# EAGLE design hacksaw_r0 (EAGLE 7.3.0)

## Sheet 1 of 4: VCO CORE
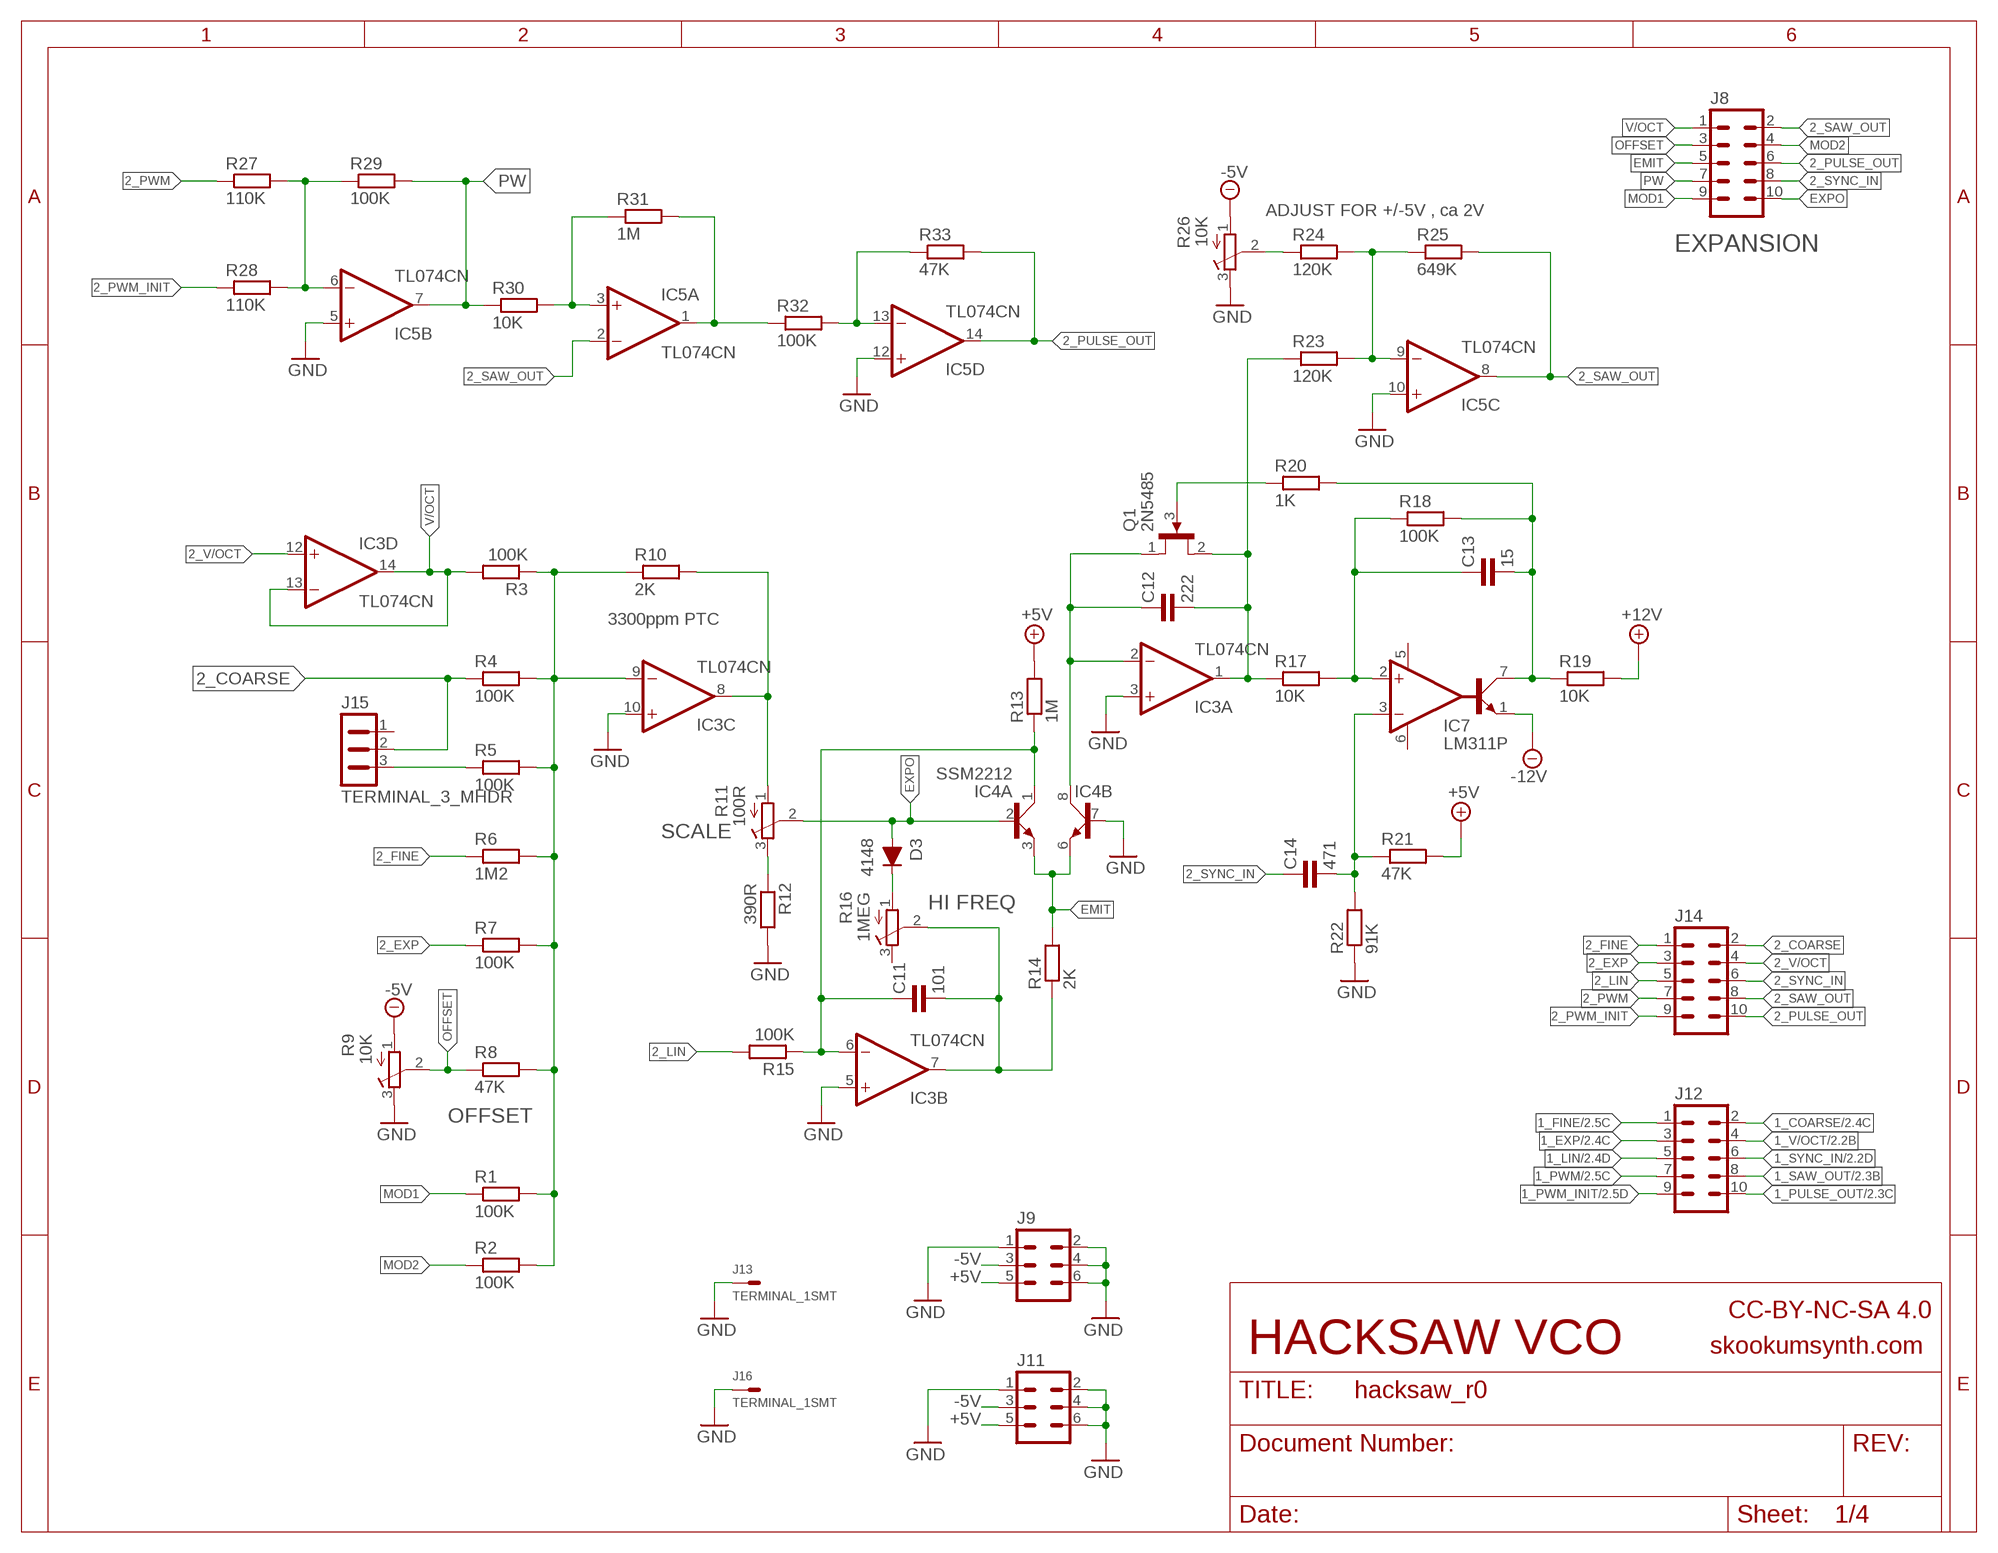
[diagram p0: schematic, sheet 1]

### Parts
C11  101  CAP_0805  [0805]
C12  222  CAP_PHE450  [PHE450]
C13  15  CAP_0805  [0805]
C14  471  CAP_0805  [0805]
D3  4148  DIODE_RECT_SOD123  [SOD123]
IC3  TL074CN  OPAMP_QUAD_DIL14  [DIL14]
IC4  SSM2212  SSM2212*  [DIL8]
IC5  TL074CN  OPAMP_QUAD_DIL14  [DIL14]
IC7  LM311P  [DIL8]
J8  CONN_HDR_5X21  [HDR_M_5X2]
J9  CONN_HDR_3X21  [HDR_M_3X2]
J11  CONN_HDR_3X22  [HDR_M_3X2_REAR]
J12  CONN_HDR_5X22  [HDR_M_5X2_REAR]
J13  TERMINAL_1SMT  [FP_GND]
J14  CONN_HDR_5X21  [HDR_M_5X2]
J15  TERMINAL_3_MHDR  [HDR_M_3]
J16  TERMINAL_1SMT  [FP_GND]
Q1  2N5485  NJFET_2N5485  [TO-92_2]
R1  100K  RESISTOR_0805  [0805]
R2  100K  RESISTOR_0805  [0805]
R3  100K  RESISTOR_0805  [0805]
R4  100K  RESISTOR_0805  [0805]
R5  100K  RESISTOR_0805  [0805]
R6  1M2  RESISTOR_0805  [0805]
R7  100K  RESISTOR_0805  [0805]
R8  47K  RESISTOR_0805  [0805]
R9  10K  RESISTOR_TRIM_PV36W  [PV36W]
R10  2K  RESISTOR_1/4W  [RESISTOR_TH_1/4W]
R11  100R  RESISTOR_TRIM_PV36W  [PV36W]
R12  390R  RESISTOR_0805  [0805]
R13  1M  RESISTOR_0805  [0805]
R14  2K  RESISTOR_0805  [0805]
R15  100K  RESISTOR_0805  [0805]
R16  1MEG  RESISTOR_TRIM_PV36W  [PV36W]
R17  10K  RESISTOR_0805  [0805]
R18  100K  RESISTOR_0805  [0805]
R19  10K  RESISTOR_0805  [0805]
R20  1K  RESISTOR_0805  [0805]
R21  47K  RESISTOR_0805  [0805]
R22  91K  RESISTOR_0805  [0805]
R23  120K  RESISTOR_0805  [0805]
R24  120K  RESISTOR_0805  [0805]
R25  649K  RESISTOR_0805  [0805]
R26  10K  RESISTOR_TRIM_PV36W  [PV36W]
R27  110K  RESISTOR_0805  [0805]
R28  110K  RESISTOR_0805  [0805]
R29  100K  RESISTOR_0805  [0805]
R30  10K  RESISTOR_0805  [0805]
R31  1M  RESISTOR_0805  [0805]
R32  100K  RESISTOR_0805  [0805]
R33  47K  RESISTOR_0805  [0805]

### Nets
1_COARSE: J12.2 ; also sheet 2
1_EXP: J12.3 ; also sheet 2
1_FINE: J12.1 ; also sheet 2
1_LIN: J12.5 ; also sheet 2
1_PULSE_OUT: J12.10 ; also sheet 2
1_PWM: J12.7 ; also sheet 2
1_PWM_INIT: J12.9 ; also sheet 2
1_SAW_OUT: J12.8 ; also sheet 2
1_SYNC_IN: J12.6 ; also sheet 2
1_V/OCT: J12.4 ; also sheet 2
2_COARSE: J14.2 J15.2 R4.1
2_EXP: J14.3 R7.1
2_FINE: J14.1 R6.1
2_LIN: J14.5 R15.2
2_PULSE_OUT: IC5.14(D:OUT) J8.6 J14.10 R33.2
2_PWM: J14.7 R27.1
2_PWM_INIT: J14.9 R28.1
2_SAW_OUT: IC5.2(A:-IN) IC5.8(C:OUT) J8.2 J14.8 R25.2
2_SYNC_IN: C14.1(+) J8.8 J14.6
2_SYNC_PULSE: C13.2(-) IC7.7(COL) R18.2 R19.1 R20.2
2_V/OCT: IC3.12(D:+IN) J14.4
+5V: J9.5 J11.5 R13.2 R21.2 ; also sheet 2,3
+12V: R19.2 ; also sheet 3
-5V: J9.3 J11.3 R9.1 R26.1 ; also sheet 2,3
-12V: IC7.1(EMIT) ; also sheet 3
C1: C11.1(+) IC3.6(B:-IN) IC4.1(A:C) R13.1 R15.1
C2: C12.1(+) IC3.2(A:-IN) IC4.8(B:C) Q1.1(D)
CV: IC3.8(C:OUT) R10.2 R11.1
EMIT: IC4.3(A:E) IC4.6(B:E) J8.5 R14.2
EXPO: D3.A IC4.2(A:B) J8.10 R11.2
GND: IC3.3(A:+IN) IC3.5(B:+IN) IC3.10(C:+IN) IC4.7(B:B) IC5.5(B:+IN) IC5.10(C:+IN) IC5.12(D:+IN) J9.1 J9.2 J9.4 J9.6 J11.1 J11.2 J11.4 J11.6 J13.P$1 J16.P$1 R9.3 R12.2 R22.1 R26.3 ; also sheet 2,3,4
MOD1: J8.9 R1.1
MOD2: J8.4 R2.1
N$3: C13.1(+) IC7.2(+IN) R17.2 R18.1
N$5: R11.3 R12.1
N$6: IC5.1(A:OUT) R31.2 R32.1
N$8: D3.K(C) R16.1
N$9: IC5.6(B:-IN) R27.2 R28.2 R29.1
N$10: Q1.3(G) R20.1
N$11: IC5.3(A:+IN) R30.2 R31.1
N$16: J15.3 R5.1
N$17: IC5.13(D:-IN) R32.2 R33.1
N$19: IC3.9(C:-IN) R1.2 R2.2 R3.1 R4.2 R5.2 R6.2 R7.2 R8.2 R10.1
N$30: IC5.9(C:-IN) R23.2 R24.2 R25.1
N$33: R24.1 R26.2
N$54: C11.2(-) IC3.7(B:OUT) R14.1 R16.2
OFFSET: J8.3 R8.1 R9.2
PW: IC5.7(B:OUT) J8.7 R29.2 R30.1
RAW: C12.2(-) IC3.1(A:OUT) Q1.2(S) R17.1 R23.1
RESET: C14.2(-) IC7.3(-IN) R21.1 R22.2
V/OCT: IC3.13(D:-IN) IC3.14(D:OUT) J8.1 R3.2
Unconnected: IC7.5(BAL) IC7.6(BAL/STROBE) J15.1 R16.3

### Notes on the sheet
- ADJUST FOR +/-5V , ca 2V
- EXPANSION
- 3300ppm PTC
- SCALE
- HI FREQ
- OFFSET
- CC-BY-NC-SA 4.0
- HACKSAW VCO | skookumsynth.com

## Sheet 2 of 4: INTERFACE
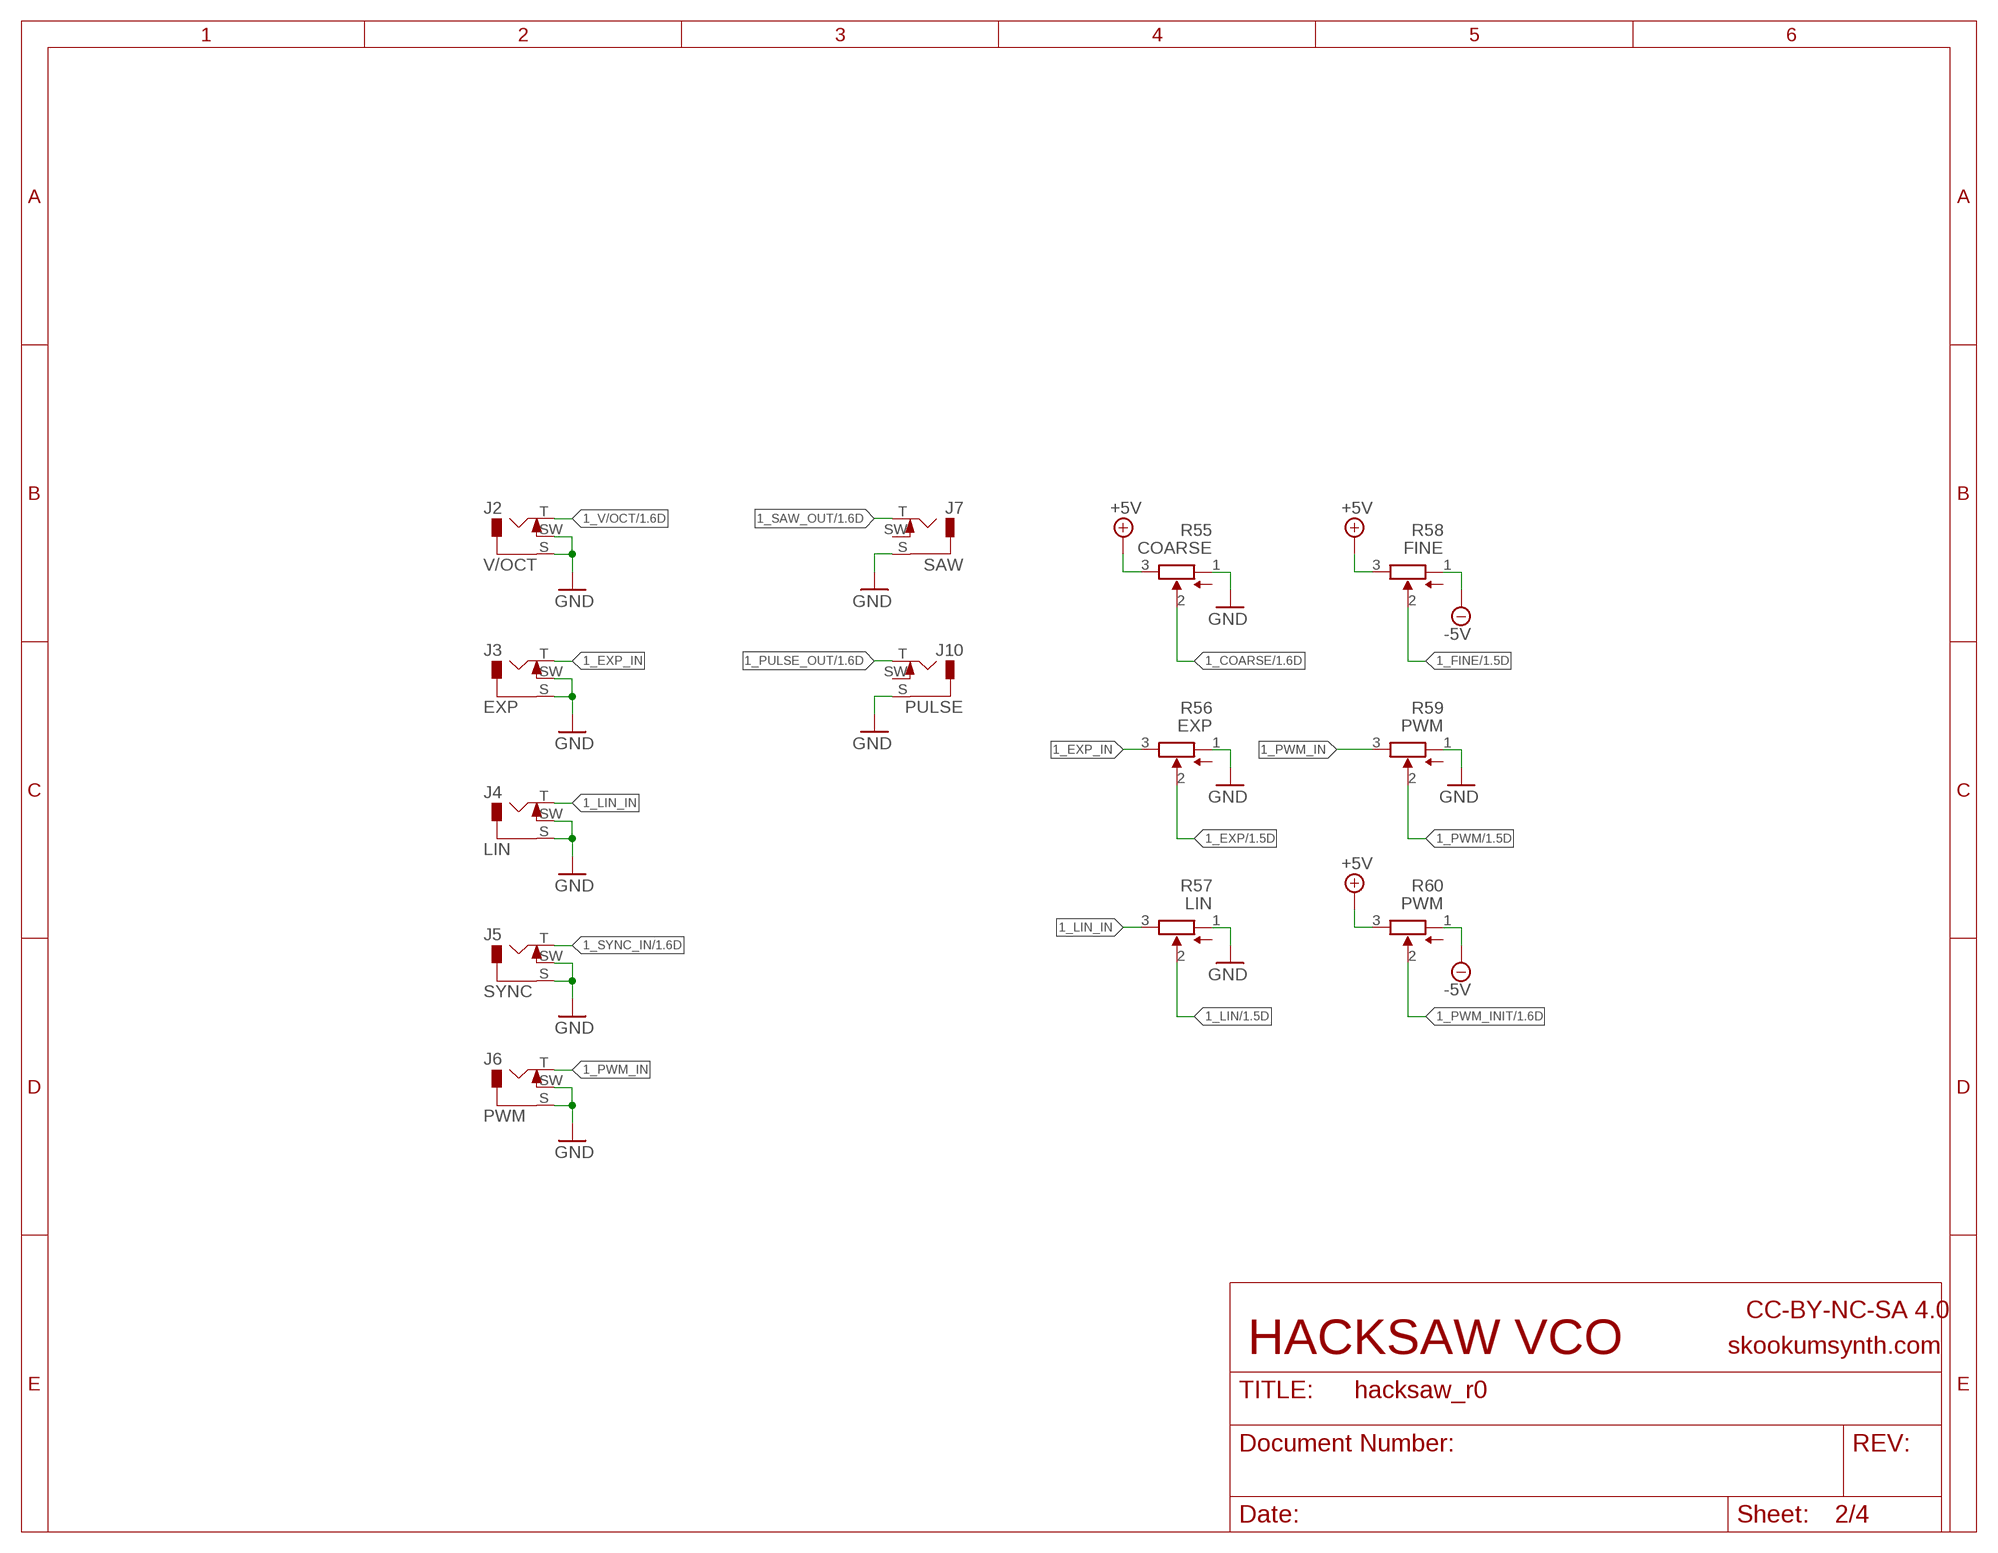
[diagram p1: schematic, sheet 2]

### Parts
J2  V/OCT  CONN_MONO_SW_F_V  [WQP_PJ301M-12]
J3  EXP  CONN_MONO_SW_F_V  [WQP_PJ301M-12]
J4  LIN  CONN_MONO_SW_F_V  [WQP_PJ301M-12]
J5  SYNC  CONN_MONO_SW_F_V  [WQP_PJ301M-12]
J6  PWM  CONN_MONO_SW_F_V  [WQP_PJ301M-12]
J7  SAW  CONN_MONO_SW_F_V  [WQP_PJ301M-12]
J10  PULSE  CONN_MONO_SW_F_V  [WQP_PJ301M-12]
R55  COARSE  POTENTIOMETER-A6  [PTV09]
R56  EXP  POTENTIOMETER-A6  [PTV09]
R57  LIN  POTENTIOMETER-A6  [PTV09]
R58  FINE  POTENTIOMETER-A6  [PTV09]
R59  PWM  POTENTIOMETER-A6  [PTV09]
R60  PWM  POTENTIOMETER-A6  [PTV09]

### Nets
1_COARSE: R55.2 ; also sheet 1
1_EXP: R56.2 ; also sheet 1
1_EXP_IN: J3.T R56.3
1_FINE: R58.2 ; also sheet 1
1_LIN: R57.2 ; also sheet 1
1_LIN_IN: J4.T R57.3
1_PULSE_OUT: J10.T ; also sheet 1
1_PWM: R59.2 ; also sheet 1
1_PWM_IN: J6.T R59.3
1_PWM_INIT: R60.2 ; also sheet 1
1_SAW_OUT: J7.T ; also sheet 1
1_SYNC_IN: J5.T ; also sheet 1
1_V/OCT: J2.T ; also sheet 1
+5V: R55.3 R58.3 R60.3 ; also sheet 1,3
-5V: R58.1 R60.1 ; also sheet 1,3
GND: J2.S J2.SW J3.S J3.SW J4.S J4.SW J5.S J5.SW J6.S J6.SW J7.S J10.S R55.1 R56.1 R57.1 R59.1 ; also sheet 1,3,4
Unconnected: J7.SW J10.SW

### Notes on the sheet
- CC-BY-NC-SA 4.0
- HACKSAW VCO | skookumsynth.com

## Sheet 3 of 4: POWER
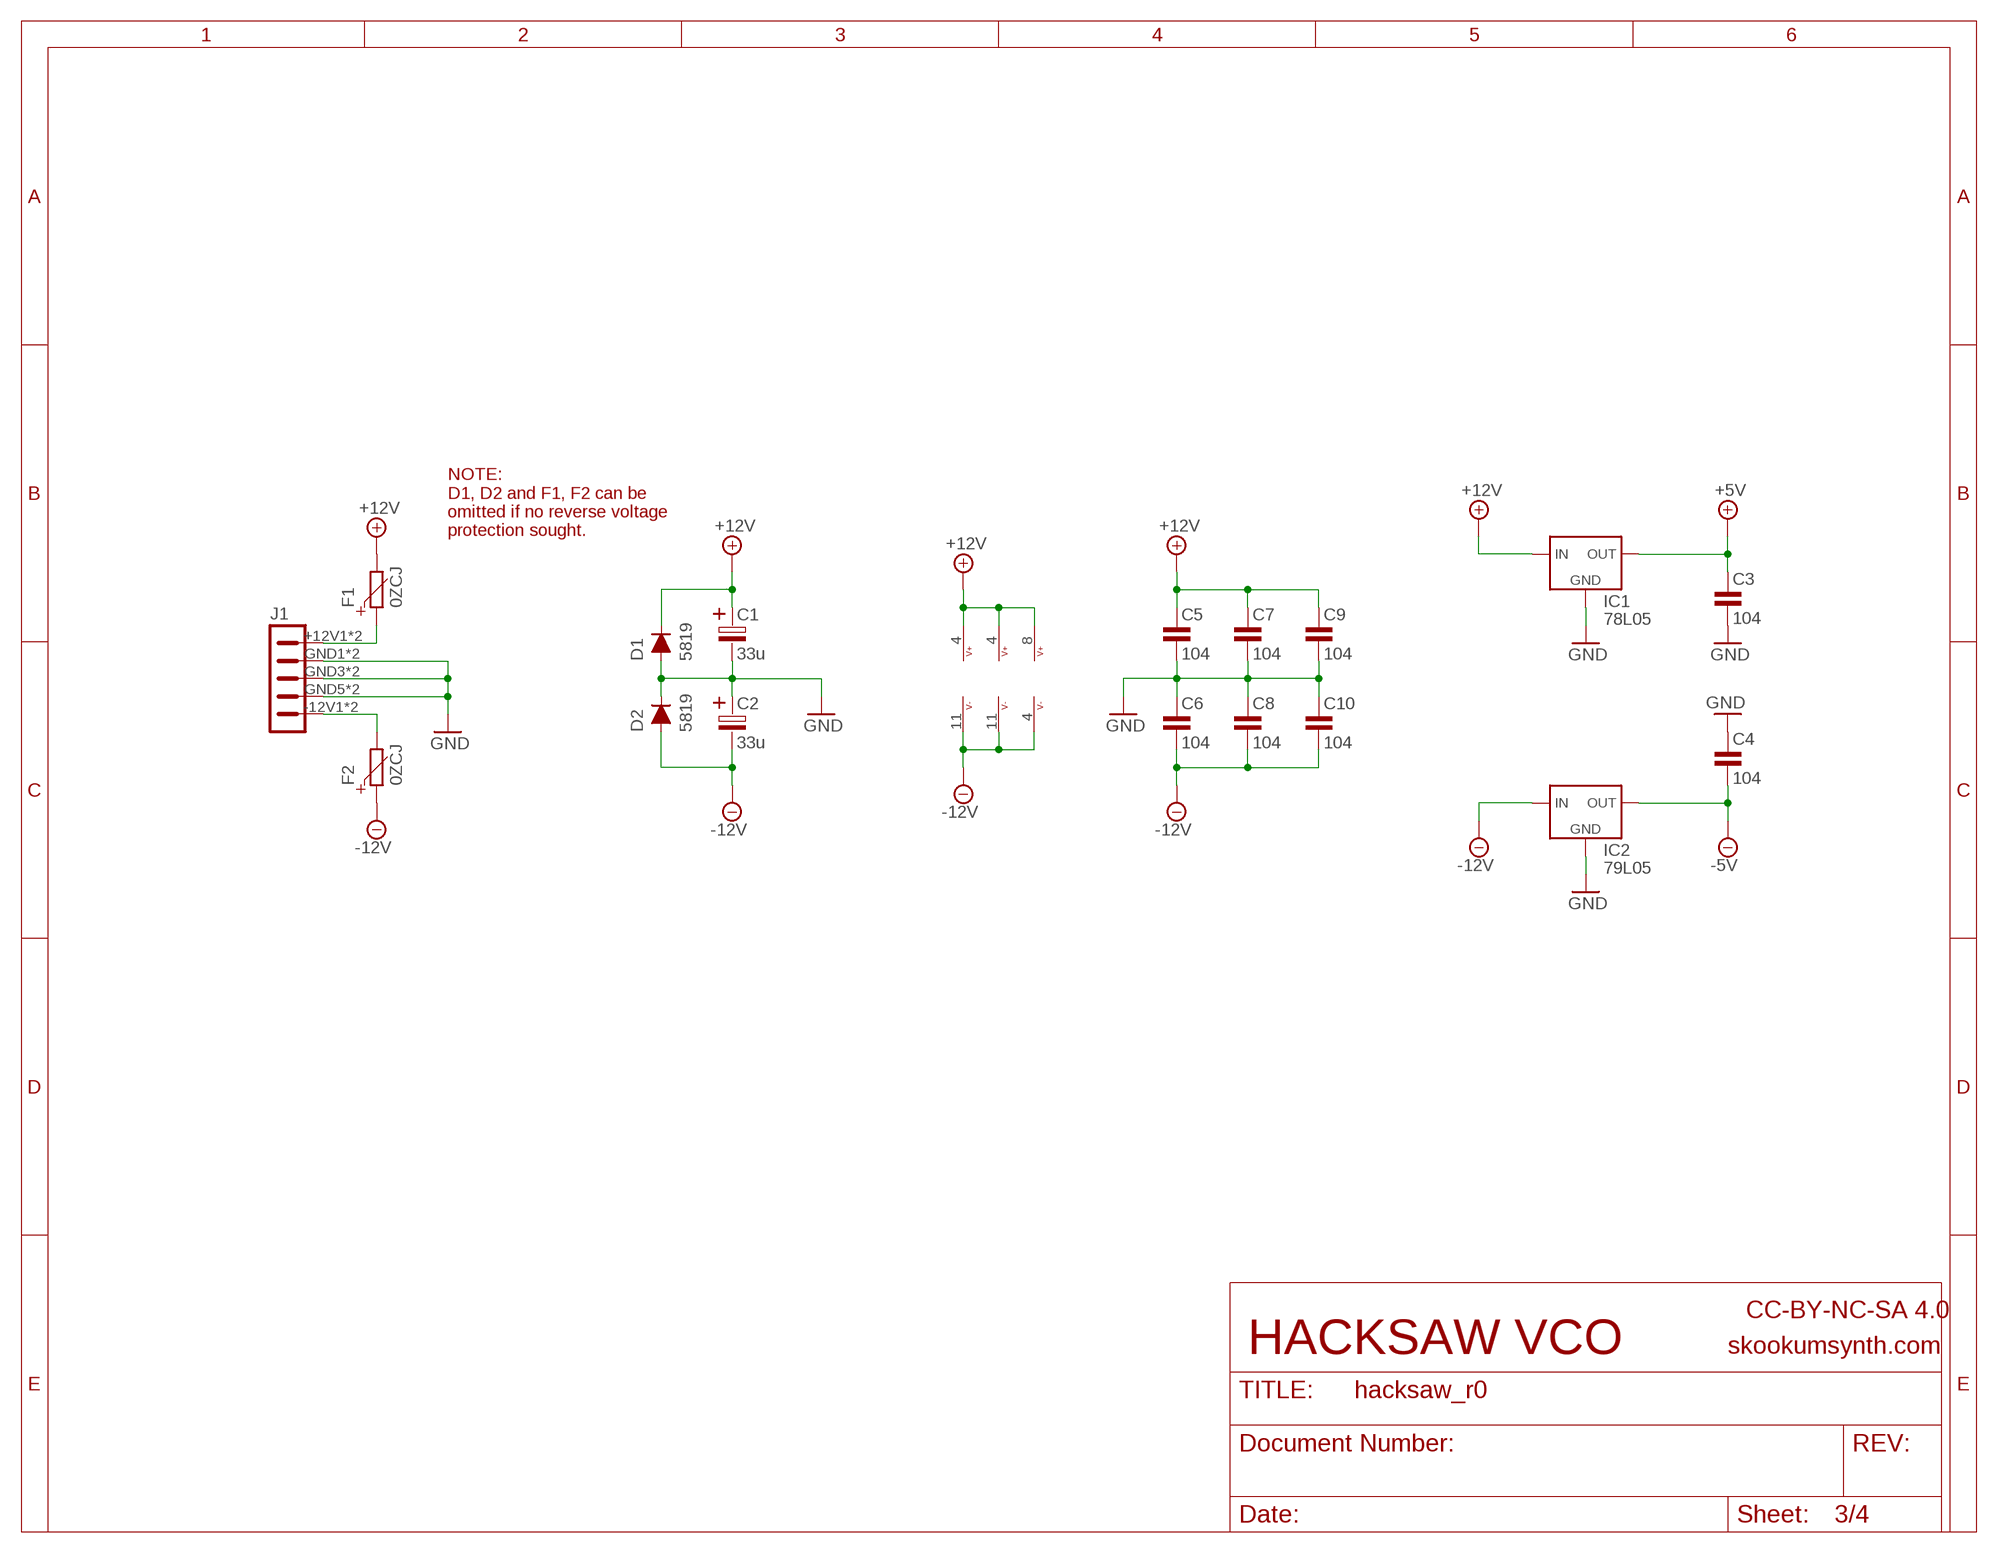
[diagram p2: schematic, sheet 3]

### Parts
C1  33u  CAP_POL_PTH_2.5-6  [CAP_POL_2.5-6]
C2  33u  CAP_POL_PTH_2.5-6  [CAP_POL_2.5-6]
C3  104  CAP_0805  [0805]
C4  104  CAP_0805  [0805]
C5  104  CAP_0805  [0805]
C6  104  CAP_0805  [0805]
C7  104  CAP_0805  [0805]
C8  104  CAP_0805  [0805]
C9  104  CAP_0805  [0805]
C10  104  CAP_0805  [0805]
D1  5819  DIODE_RECT_SOD123  [SOD123]
D2  5819  DIODE_RECT_SOD123  [SOD123]
F1  0ZCJ  PTC_0ZCJ  [1206]
F2  0ZCJ  PTC_0ZCJ  [1206]
IC1  78L05  78LXXACLPR  [TO-92_2]
IC2  79L05  79LXXACLPR  [TO-92_2]
J1  HDR_POWER_10_VERT  [HDR_POWER_10]

### Nets
+5V: C3.1(+) IC1.1(OUT) ; also sheet 1,2
+12V: C1.+ C5.1(+) C7.1(+) C9.1(+) D1.K(C) F1.2 IC1.3(IN) IC3.4(PWR:V+) IC5.4(PWR:V+) IC7.8(V+) ; also sheet 1
-5V: C4.2(-) IC2.3(OUT) ; also sheet 1,2
-12V: C2.- C6.2(-) C8.2(-) C10.2(-) D2.A F2.1 IC2.2(IN) IC3.11(PWR:V-) IC5.11(PWR:V-) IC7.4(V-) ; also sheet 1
GND: C1.- C2.+ C3.2(-) C4.1(+) C5.2(-) C6.1(+) C7.2(-) C8.1(+) C9.2(-) C10.1(+) D1.A D2.K(C) IC1.2(GND) IC2.1(GND) J1.GND1 J1.GND2 J1.GND3 J1.GND4 J1.GND5 J1.GND6 ; also sheet 1,2,4
N$4: F1.1 J1.+12V1 J1.+12V2
N$41: F2.2 J1.-12V1 J1.-12V2

### Notes on the sheet
- NOTE:
  D1, D2 and F1, F2 can be
  omitted if no reverse voltage 
  protection sought.
- CC-BY-NC-SA 4.0
- HACKSAW VCO | skookumsynth.com

## Sheet 4 of 4: MECHANICAL
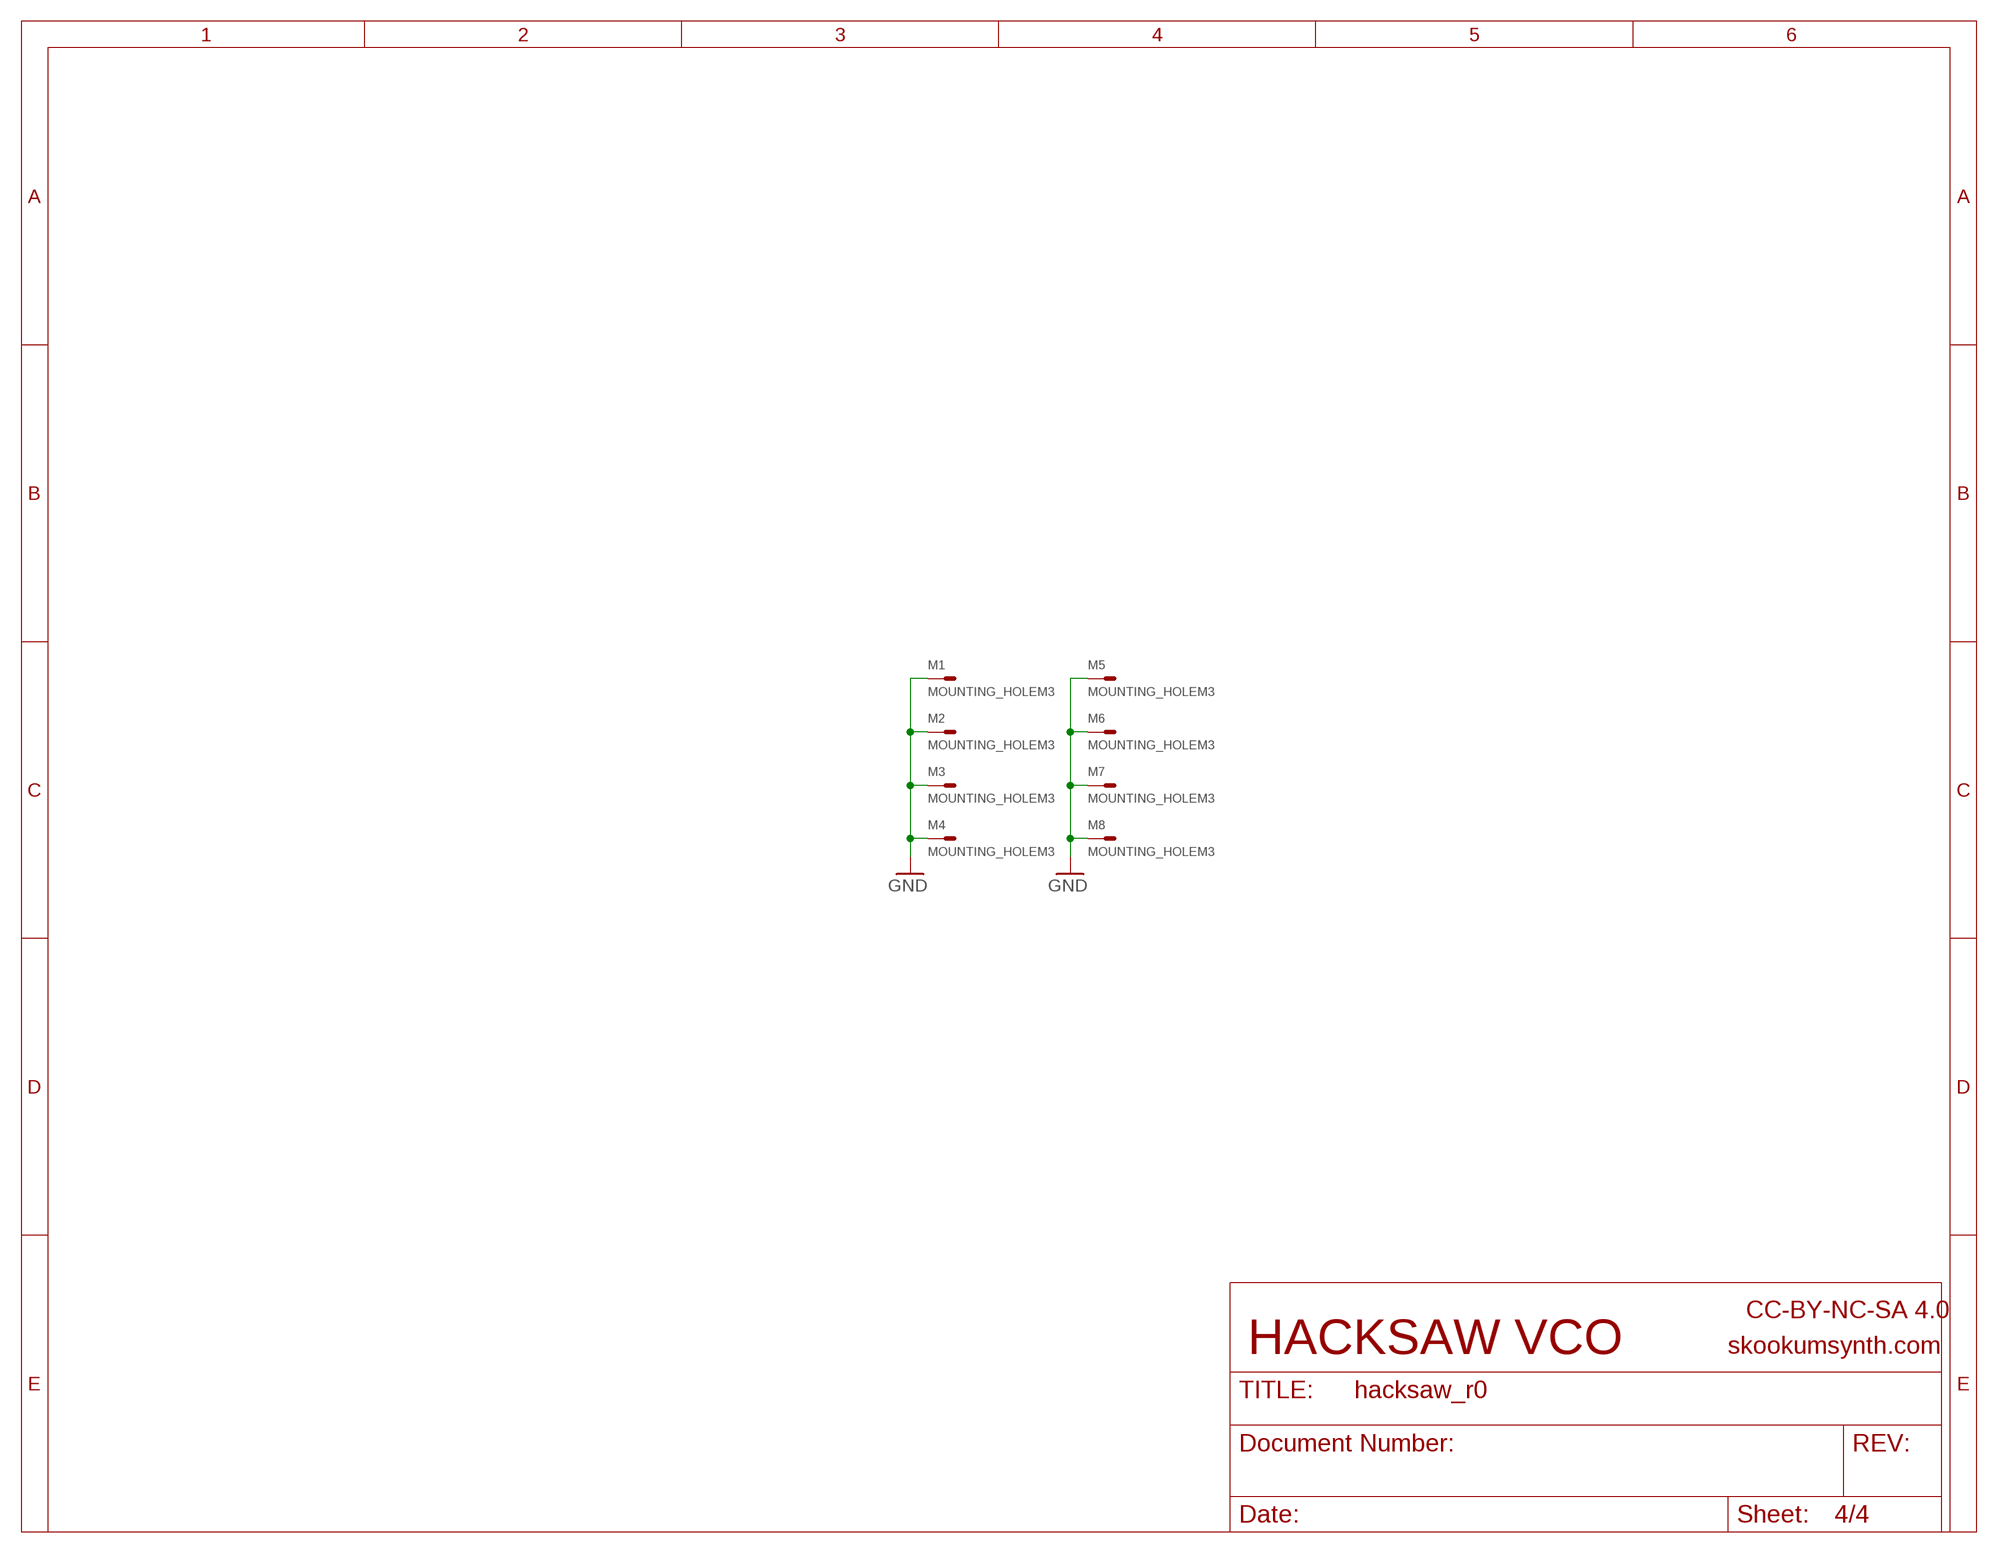
[diagram p3: schematic, sheet 4]

### Parts
M1  MOUNTING_HOLEM3  [M3]
M2  MOUNTING_HOLEM3  [M3]
M3  MOUNTING_HOLEM3  [M3]
M4  MOUNTING_HOLEM3  [M3]
M5  MOUNTING_HOLEM3  [M3]
M6  MOUNTING_HOLEM3  [M3]
M7  MOUNTING_HOLEM3  [M3]
M8  MOUNTING_HOLEM3  [M3]

### Nets
GND: M1.M3 M2.M3 M3.M3 M4.M3 M5.M3 M6.M3 M7.M3 M8.M3 ; also sheet 1,2,3

### Notes on the sheet
- CC-BY-NC-SA 4.0
- HACKSAW VCO | skookumsynth.com

## Library data of the parts
C1 C2 = 000:CAP_POL: Capacitor - Polarized
C3-C14 = 000:CAP: Capacitor - Non-polarized
D1-D3 = 000:DIODE_RECT: Diode, rectifier, generic
F1 F2 = 000:PTC: BELFUSE 0ZCJ SERIES MURATA PTGL SERIES
IC1 = 000:78LXX: *UNVERIFIED* 78LXX - Fixed voltage regulator. This series of fixed-voltage integrated-circuit voltage regulators is designed for a wide range of applications. These applications include on-card regulation for elimination of noise and distribution problems associated with single-point regulation. In addition, they can be used with power-pass elements • Internal Short-Circuit Current Limiting to make high-current voltage regulators. One of these regulators can deliver up to 100 mA of output current. The internal limiting and thermal-shutdown features of these regulators essentially make them immune to overload. When used as a replacement for a Zener diode-resistor combination, an effective improvement in output impedance can be obtained, together with lower bias current. The μ A78L00C and μ A78L00AC series devices are characterized for operation over the virtual junction temperature range of 0 ° C to 125 ° C. The μ A78L05AI device is characterized for operation over the virtual junction temperature range of − 40 ° C to 125 ° C. MFG Part no.: UA78L05ACLPR Digi-Key Part no.: 296-1365-1-ND Mouser Part no.: - Datasheet: http://www.ti.com/lit/ds/symlink/ua78l10a.pdf
IC2 = 000:79LXX: *UNVERIFIED* 79LXX - Fixed negative voltage regulator. This series of fixed negative-voltage integrated-circuit voltage regulators is designed for a wide range of applications. These include on-card regulation for elimination of noise and distribution problems associated with single-point regulation. In addition, they can be used to control series pass elements to make high-current voltage-regulator circuits. One of these regulators can deliver up to 100 mA of output current. The internal current-limiting and thermal-shutdown features essentially make the regulators immune to overload. When used as a replacement for a Zener-diode and resistor combination, these devices can provide an effective improvement in output impedance of two orders of magnitude, with lower bias current. MFG Part no.: MC79L05ACLPR Digi-Key Part no.: 296-31456-1-ND Mouser Part no.: - Datasheet: http://www.ti.com/lit/ds/symlink/mc79l05a.pdf
IC3 IC5 = 000:OPAMP_QUAD
IC4 = 000:SSM2212: *UNVERIFIED* The SSM2212 is a dual, NPN-matched transistor pair that is specifically designed to meet the requirements of ultralow noise audio systems. With its extremely low input base spreading resistance (rbb' is typically 28 Ω) and high current gain (h FE typically exceeds 600 at I C = 1 mA), the SSM2212 can achieve outstanding signal-to-noise ratios. The high current gain results in superior performance compared to systems incorporating commercially available monolithic amplifiers. Excellent matching of the current gain (Δh FE ) to approximately 0.5% and low V OS of less than 10 μV typical make the SSM2212 ideal for symmetrically balanced designs, which reduce high- order amplifier harmonic distortion. Stability of the matching parameters is guaranteed by protection diodes across the base-emitter junction. These diodes prevent degradation of beta and matching characteristics due to reverse biasing of the base-emitter junction. The SSM2212 is also an ideal choice for accurate and reliable current biasing and mirroring circuits. Furthermore, because the accuracy of a current mirror degrades exponentially with mismatches of V BE between transistor pairs, the low V OS of the SSM2212 does not need offset trimming in most circuit applications. The SSM2212 SOIC performance and characteristics are guaranteed over the extended temperature range of −40°C to +85°C. The SSM2212 is available in 8-lead SOIC and 16-lead LFCSP packages.
IC7 = 000:LM311
J1 = 000:HDR_POWER_10: 10 Pin Euroack power header with -12V indication CNC Tech P/N: 3020-10-0100-00 - VERTICAL 3020-10-0200-00 - RIGHT ANGLE
J2-J7 J10 = 000:CONN_MONO_SW_F: 3.5mm mono switched jacks WQP-PJ301M-12 - Available at: http://erthenvar.com and http://www.thonk.co.uk/
J8 J12 J14 = 000:CONN_HDR_5X2
J9 J11 = 000:CONN_HDR_3X2
J13 J16 = 000:TERMINAL_1
J15 = 000:TERMINAL_3
M1-M8 = 000:MOUNTING_HOLE
Q1 = 000:NJFET: *UNVERIFIED*
R1-R8 R10 R12-R15 R17-R25 R27-R33 = 000:RESISTOR: RESISTOR - THROUGH HOLE Footprint based on Stackpole Electronics RNF series 1/4W = RNF14 2W = Vishay PRO2
R9 R11 R16 R26 = 000:RESISTOR_TRIM: Trim Resistor - Generic Package based on: Bourns PV36W
R55-R60 = 000:POTENTIOMETER: *UNVERIFIED* BOURNS PTV09A-6 NOTE: USE MILLING LAYER FOR SLOTS Panel controls are designed for applications that typically require frequent adjustment. Both rotary and slide panel control types are available. A selection of elements includes carbon, cermet, and conductive plastic. These devices are available in various sizes and shaft/bushing combinations. Some models are available with a rotary switch and seal options. Typical applications include audio mixing consoles, test and measurement equipment, consumer electronics, and medical equipment.Turns-counting dials are designed for use with precision rotary potentiometers or other types of panel controls where a turns-indicating device or an adjustment setting/locking device is needed. These devices are available to fit various shaft sizes in digital or concentric scale (analog) readout options. Typical applications include power supplies, oscilloscopes, medical equipment, and industrial automation equipment.

## Board
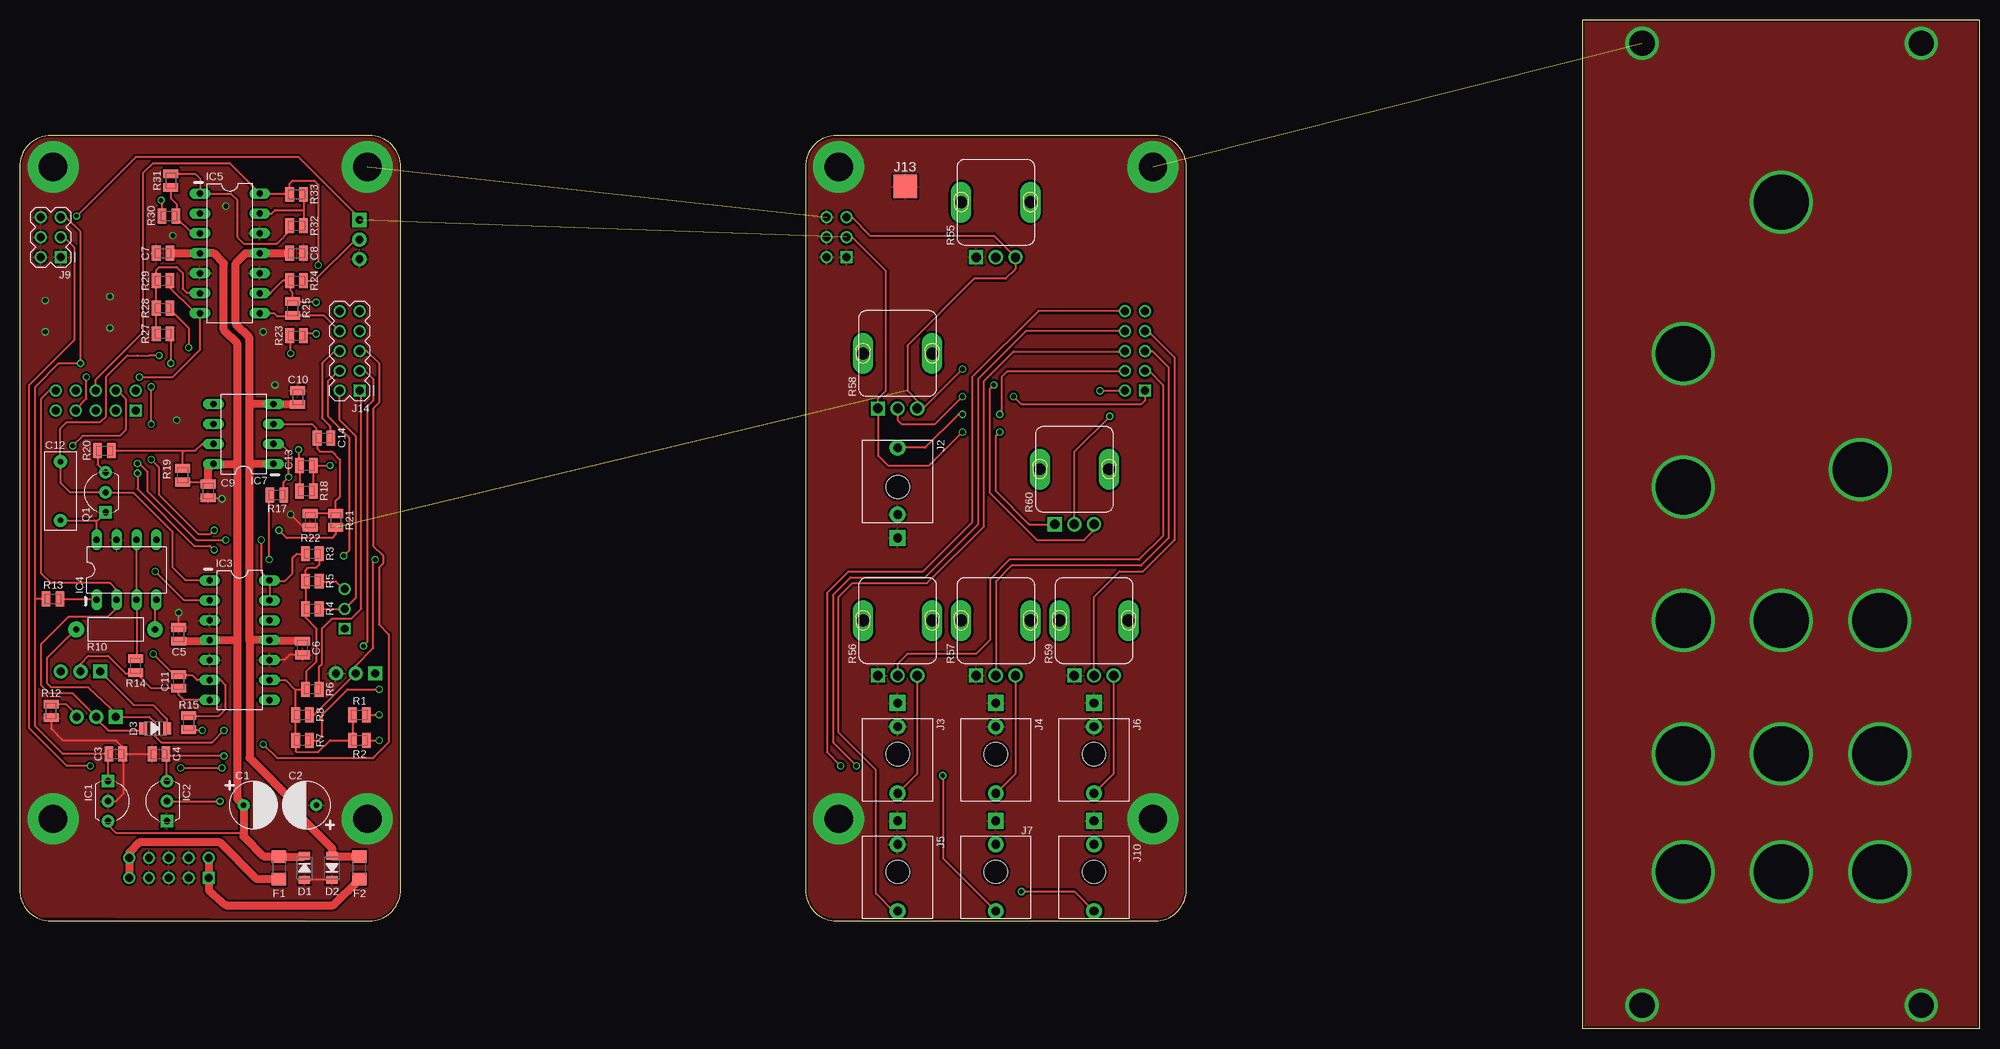
[diagram p4: board, top side]
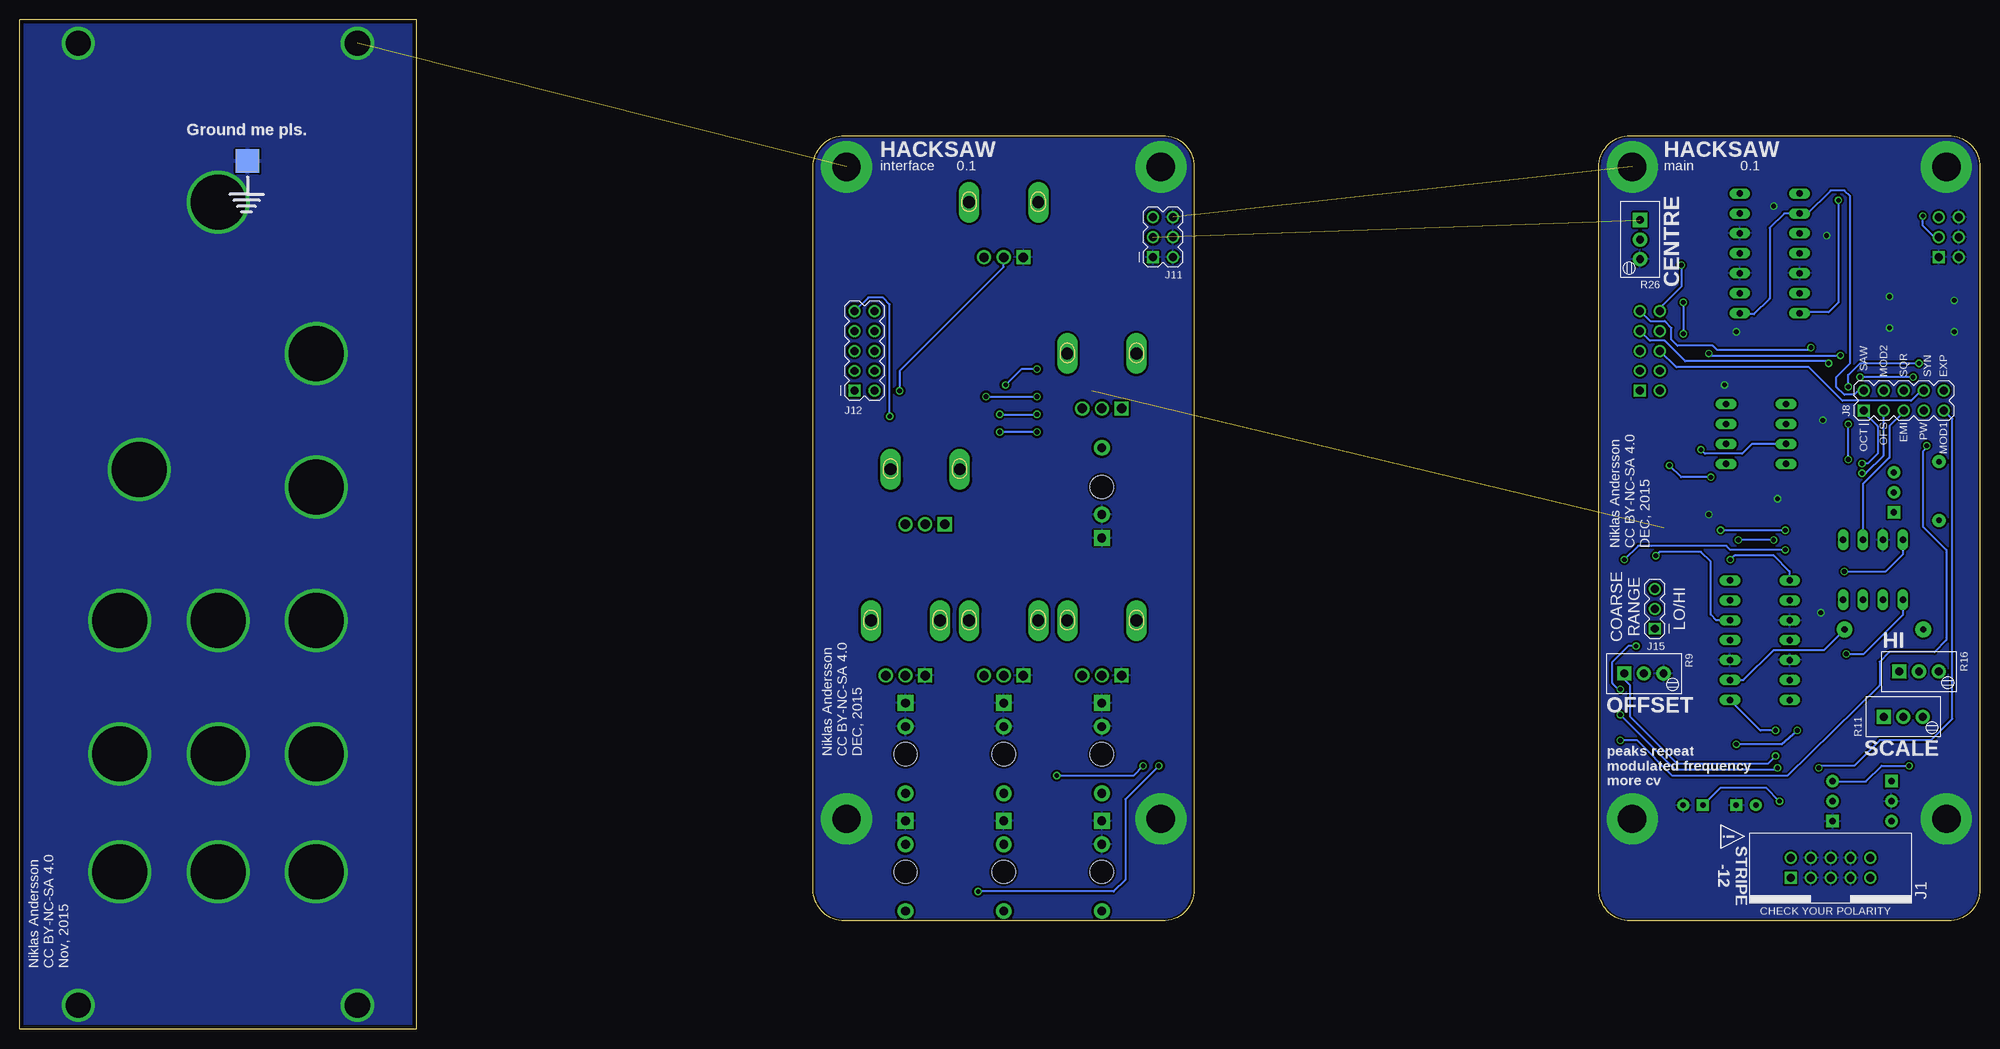
[diagram p5: board, bottom side, seen from below]

Size 249.5 x 128.5 mm. Coordinates in mm from the lower left corner, seen from the top.
Outline: 148.5,17.75 148.5,109.75 arc90 144.5,113.75 104,113.75 arc90 100,109.75 100,17.75 arc90 104,13.75 144.5,13.75 arc90 148.5,17.75
Outline: 249.5,0 199,0 199,128.5 249.5,128.5 249.5,0
Outline: 4,13.75 44.5,13.75 arc90 48.5,17.75 48.5,109.75 arc90 44.5,113.75 4,113.75 arc90 0,109.75 0,17.75 arc90 4,13.75
Copper layers (1*16): Top 0.035mm / dielectric 1.5mm / Bottom 0.035mm
Design rules "dirt_cheap_dirty_boards.v1 *": minimum track width 5mil, minimum drill 12mil, track to track 6mil, track to pad 6mil, pad to pad 6mil, via to via 6mil, smd to smd 0mil, copper to edge 10mil, drill to drill 10mil, minimum pad ring 10mil, minimum via ring 6mil, stop-mask expansion 2mil, vias tented up to drill 25mil, thermal gap 10mil

### Footprints (pad centres in the part's own frame; a part is rotated, then mirrored left to right if it is on the bottom)
CAP_POL_2.5-6 = drill 0.7 pad 1.5: + -1.25,0 | drill 0.7 pad 1.5 square: - 1.25,0
0805 = smd 1.1 x 1.9: 1 -0.875,0; 2 0.875,0
PHE450 = drill 0.7 pad 1.7: 1 -3.75,0; 2 3.75,0
SOD123 = smd 1 x 1.5: A 1.525,0; K -1.525,0
1206 = smd 1.6 x 1.803: 1 -1.422,0; 2 1.422,0
TO-92_2 = drill 0.8 pad 1.6 square: 1 -2.54,0 | drill 0.8 pad 1.6: 2 0,0; 3 2.54,0
DIL14 = drill 0.813 long: 1 -7.62,-3.81; 2 -5.08,-3.81; 3 -2.54,-3.81; 4 0,-3.81; 5 2.54,-3.81; 6 5.08,-3.81; 7 7.62,-3.81; 8 7.62,3.81; 9 5.08,3.81; 10 2.54,3.81; 11 0,3.81; 12 -2.54,3.81; 13 -5.08,3.81; 14 -7.62,3.81
DIL8 = drill 0.813 long: 1 -3.81,-3.81; 2 -1.27,-3.81; 3 1.27,-3.81; 4 3.81,-3.81; 5 3.81,3.81; 6 1.27,3.81; 7 -1.27,3.81; 8 -3.81,3.81
HDR_POWER_10 = drill 1.016: +12V1 5.08,1.27; +12V2 5.08,-1.27; -12V1 -5.08,1.27; GND1 2.54,1.27; GND2 2.54,-1.27; GND3 0,1.27; GND4 0,-1.27; GND5 -2.54,1.27; GND6 -2.54,-1.27 | drill 1.016 square: -12V2 -5.08,-1.27
WQP_PJ301M-12 = drill 1.1 pad 2 square: S 0,-6.5 | drill 1.1 pad 2: SW 0,-3.5; T 0,5 | hole 3: 0,0
HDR_M_5X2 = drill 1.016 square: 1 0,0 | drill 1.016: 2 0,2.54; 3 2.54,0; 4 2.54,2.54; 5 5.08,0; 6 5.08,2.54; 7 7.62,0; 8 7.62,2.54; 9 10.16,0; 10 10.16,2.54
HDR_M_3X2 = drill 1.016 square: 1 0,0 | drill 1.016: 2 0,2.54; 3 2.54,0; 4 2.54,2.54; 5 5.08,0; 6 5.08,2.54
HDR_M_3X2_REAR = drill 1.016 square: 1 0,0 | drill 1.016: 2 0,2.54; 3 2.54,0; 4 2.54,2.54; 5 5.08,0; 6 5.08,2.54
HDR_M_5X2_REAR = drill 1.016 square: 1 0,0 | drill 1.016: 2 0,2.54; 3 2.54,0; 4 2.54,2.54; 5 5.08,0; 6 5.08,2.54; 7 7.62,0; 8 7.62,2.54; 9 10.16,0; 10 10.16,2.54
FP_GND = smd 3 x 3 bottom: P$1 0,0
HDR_M_3 = drill 1.016 square: 1 -2.54,0 | drill 1.016: 2 0,0; 3 2.54,0
M3 = drill 3.6 pad 6.5: M3 0,0
PV36W = drill 1 pad 1.8 square: 1 -2.5,0 | drill 1 pad 1.8: 2 0,0; 3 2.5,0
RESISTOR_TH_1/4W = drill 0.8 pad 2: 1 -5,0; 2 5,0
PTV09 = drill 1.2 pad 1.8 square: 1 -2.5,-7 | drill 1.2 pad 1.8: 2 0,-7; 3 2.5,-7 | drill 1.5 pad 2.6 long: NC1 -4.4,0; NC2 4.4,0

### Placement (x,y rotation side)
C1  29.75,28.5 0 top
C2  36.5,28.5 180 top
C3  12.25,35 0 top
C4  17.75,35 0 top
C5  20.25,50.25 90 top
C6  36,48.5 90 top
C7  18.25,98.75 180 top
C8  35.25,98.75 180 top
C9  24,68.5 270 top
C10  35.41,80.41 270 top
C11  20.25,44.25 270 top
C12  5.18,68.49 90 top
C13  36.5,71.75 180 top
C14  38.75,75.25 180 top
D1  36.25,20.5 270 top
D2  39.75,20.5 90 top
D3  17.25,38.25 180 top
E$1  [PANEL_OUTPUT]  224.25,20 0 bottom
E$2  [PANEL_OUTPUT]  236.75,20 0 bottom
F1  33,20.5 90 top
F2  43.25,20.5 270 top
IC1  11.25,29 270 top
IC2  18.75,29 90 top
IC3  28,49.5 270 top
IC4  13.6,58.46 0 top
IC5  26.75,98.75 270 top
IC7  28.5,75.75 90 top
J1  19,20.5 0 bottom
J2  111.75,69 0 top
J3  111.75,35 180 top
J4  124.25,35 180 top
J5  111.75,20 180 top
J6  136.75,35 180 top
J7  124.25,20 180 top
J8  14.75,78.75 0 bottom
J9  5.25,98.25 90 top
J10  136.75,20 180 top
J11  105.25,98.25 90 top
J12  143.25,81.25 90 top
J13  112.75,107.25 0 bottom
J14  43.25,81.25 90 top
J15  41.38,53.5 90 bottom
J16  220.5,110.5 0 top
M1  144.25,109.75 0 top
M2  4.25,26.75 0 top
M3  44.25,26.75 0 top
M4  4.25,109.75 0 top
M5  44.25,109.75 0 top
M6  104.25,26.75 0 top
M7  144.25,26.75 0 top
M8  104.25,109.75 0 top
Q1  10.95,68.31 90 top
R1  43.25,40 180 top
R2  43.25,36.75 180 top
R3  37.25,60.5 180 top
R4  37.25,53.5 180 top
R5  37.25,57 180 top
R6  37.25,43.25 180 top
R7  36,36.75 180 top
R8  36,40 180 top
R9  42.75,45.25 0 bottom
R10  12.21,50.86 180 top
R11  9.75,39.75 0 bottom
R12  4,40.5 270 top
R13  4.25,54.75 180 top
R14  14.75,46.25 90 top
R15  21.5,39 270 top
R16  7.75,45.5 0 bottom
R17  32.75,68 0 top
R18  36.5,68.5 180 top
R19  20.75,70.5 270 top
R20  10.8,73.62 0 top
R21  40.25,64.75 270 top
R22  37,64.75 90 top
R23  35.25,88.25 0 top
R24  35.25,95.25 180 top
R25  34.75,91.75 270 top
R26  43.25,100.5 270 bottom
R27  18.25,88.5 180 top
R28  18.25,91.75 180 top
R29  18.25,95.25 0 top
R30  19,103.5 0 top
R31  19.25,108 90 top
R32  35.25,102.25 0 top
R33  35.25,106.25 180 top
R55  124.25,105.25 0 top
R56  111.75,52 0 top
R57  124.25,52 0 top
R58  111.75,86 0 top
R59  136.75,52 0 top
R60  134.25,71.25 0 top

### Tracks (layer width: path | path; a pad name or v marks a point on that pad's centre or on a via)
1_COARSE  (via drill 0.6)
  Top 0.25: v137.5,81.25 J12.2
  Bottom 0.25: v137.5,81.25 137.5,83.75 124.25,97 R55.2
1_EXP
  Top 0.25: R56.2 111.75,46.5 113,47.75 121.75,47.75 123.5,49.5 123.5,57.25 126,59.75 142.5,59.75 145.5,62.75 145.5,82 143.79,83.75 143.29,83.75 J12.3
1_EXP_IN
  Top 0.25: R56.3 114.25,32.5 J3.T
1_FINE  (via drill 0.6)
  Top 0.25: J12.1 143.25,80 142.75,79.5 127.5,79.5 v126.5,80.5 | R58.2 111.75,77.5 112.25,77 116.5,77 v120,80.5
  Bottom 0.25: v126.5,80.5 v120,80.5
1_LIN
  Top 0.25: R57.2 124.25,57 126.25,59 142.75,59 146.25,62.5 146.25,84.25 144.25,86.25 143.33,86.25 J12.5
1_LIN_IN
  Top 0.25: R57.3 126.75,32.5 J4.T
1_PULSE_OUT  (via drill 0.6)
  Top 0.25: J12.10 129.66,91.41 121.25,83 121.25,64.5 115,58.25 105.5,58.25 102.75,55.5 102.75,35.25 v104.5,33.5 | v127.5,17.5 134.25,17.5 J10.T
  Bottom 0.25: v127.5,17.5 110.25,17.5 108.75,19 108.75,29.25 v104.5,33.5
1_PWM
  Top 0.25: R59.2 136.75,55 140,58.25 143,58.25 147,62.25 147,85.5 143.63,88.87 J12.7
1_PWM_IN
  Top 0.25: R59.3 139.25,32.5 J6.T
1_PWM_INIT  (via drill 0.6)
  Top 0.25: R60.2 134.25,73.5 v138.75,78
  Bottom 0.25: v138.75,78 138.75,92.25 139.62,93.12 141.47,93.12 J12.9
1_SAW_OUT  (via drill 0.6)
  Top 0.25: J12.8 128.12,88.87 122,82.75 122,64.25 115.25,57.5 105.75,57.5 103.5,55.25 103.5,36.5 v106.5,33.5 | v117.5,32.25 117.5,21.75 J7.T
  Bottom 0.25: v106.5,33.5 107.75,32.25 v117.5,32.25
1_SYNC_IN
  Top 0.25: J12.6 140.38,86.25 126.5,86.25 122.75,82.5 122.75,64 115.5,56.75 106,56.75 104.25,55 104.25,37.75 109,33 109,17.25 111.25,15 J5.T
1_V/OCT  (via drill 0.6)
  Top 0.25: J12.4 140.42,83.75 125.75,83.75 125,83 125,78.5 v124.75,78.25 | J2.T 115.25,74 119.5,78.25 v120,78.25
  Bottom 0.25: v124.75,78.25 v120,78.25
2_COARSE
  Top 0.25: R4.1 J15.2 42.75,54.87 42.75,75.5 40.75,77.5 40.75,81.21 J14.2
2_EXP  (via drill 0.6)
  Top 0.25: J14.3 43.96,83.79 45,82.75 45,80 44.25,79.25 44.25,49.25 v43.75,48.75 | R7.1 38,36.75 38.5,37.25 38.5,40 41.75,43.25 v45.75,43.25
  Bottom 0.25: v45.75,43.25 46,43.25 46.75,44 46.75,46.75 44.75,48.75 v43.75,48.75
2_FINE
  Top 0.25: R6.1 38.12,46.12 38.5,46.5 38.5,51 39.75,52.25 42.25,52.25 43.5,53.5 43.5,81 J14.1
2_LIN  (via drill 0.6)
  Top 0.25: v23.25,38 21.62,38 R15.2 | J14.5 44.17,86.33 45.75,84.75 45.75,79.75 45,79 45,61.5 46.25,60.25 46.25,59.25 45.75,58.75 45.75,51.5 47,50.25 47,36.5 45,34.5 32.75,34.5 v31,36.25
  Bottom 0.25: v31,36.25 25.25,36.25 v23.25,38
2_PULSE_OUT  (via drill 0.6)
  Top 0.25: J8.6 9.67,82.67 15.75,88.75 15.75,109 17,110.25 26.75,110.25 30.56,106.44 IC5.14 30.68,106.25 R33.2 34.38,107.62 34.75,108 37.5,108 38,107.5 v38,97.25
  Bottom 0.25: 30.44,106.25 IC5.14 | v38,97.25 38,94.5 40.75,91.75 40.75,91.45 J14.10
2_PWM  (via drill 0.6)
  Top 0.25: R27.1 19.25,88.5 v19.25,84.75
  Bottom 0.25: v19.25,84.75 19.5,85 37.5,85 40.12,87.62 42,87.62 J14.7
2_PWM_INIT  (via drill 0.6)
  Top 0.25: R28.1 19.12,91.62 21.5,89.25 v21.5,86.75
  Bottom 0.25: J14.9 41.97,90.12 40.12,90.12 39.25,89.25 39.25,87.75 38.5,87 34,87 33.5,86.5 21.75,86.5 v21.5,86.75
2_SAW_OUT
  Top 0.25: IC5.8 32.37,91.13 32.75,90.75 34.62,90.75 R25.2 38.7,90.88 J14.8
  Bottom 0.25: 14.71,81.29 J8.2 15.46,81.29 16,80.75 17.25,80.75 18.25,81.75 18.25,83 16.5,84.75 16.5,106 17.25,106.75 19,106.75 22,103.75 22.86,103.75 IC5.2 24.92,103.83 26.75,102 26.75,93 28.75,91 30.43,91 IC5.8
2_SYNC_IN
  Top 0.25: J14.6 40.08,86.33 38.5,84.75 38.5,77.75 39.5,76.75 39.5,75.38 C14.1
  Bottom 0.25: J8.8 7.46,81.29 8.75,80 17.5,80 21.75,84.25 38.63,84.25 J14.6
2_SYNC_PULSE  (via drill 0.6)
  Top 0.25: R20.2 21,73.62 | 21,73.62 22.37,73.62 23.25,74.5 24.67,74.5 IC7.7 | R18.2 C13.2 35.5,71.88 v35.5,73.75 | R19.1 20.75,73.37 21,73.62
  Bottom 0.25: IC7.7 29.02,74.48 30.25,73.25 35,73.25 v35.5,73.75
2_V/OCT  (via drill 0.6)
  Top 0.25: v41.25,60.25 42,61 42,75.25 39.25,78 39.25,82.5 40.54,83.79 J14.4
  Bottom 0.25: IC3.12 33.54,52.04 34.25,52.75 34.25,59.5 35.5,60.75 40.75,60.75 v41.25,60.25
+5V  (via drill 0.6)  (1 unrouted)
  Top 0.25: IC1.1 11.25,34.88 C3.1 5.5,35 2,38.5 2,54.75 | R13.2 2,54.75 | 2,54.75 2,81.75 5,84.75 v7.75,84.75 7.75,101.5 6,103.25 5.33,103.25 J9.5 | R21.2 40.25,63 39.75,62.5 34,62.5 v33,63.5 | v16.75,72.5 17.75,71.5 17.75,68 22.75,63 24.25,63 v24.75,63.5 | v16.75,77 v16.75,81.75 | J11.5 105.92,103.33 108.25,101 124,101 R55.3 126.75,96.75 125.5,95.5 121.5,95.5 113,87 113,81.25 114.25,80 R58.3 115,79 v120,84 | R60.3 136.75,63.5 135.5,62.25 129.5,62.25 123.5,68.25 123.5,81.5 v124,82
  Bottom 0.25: v33,63.5 v24.75,63.5 | v7.75,84.75 15.25,84.75 16.75,83.25 v16.75,81.75 | v16.75,72.5 v16.75,77 | v120,84 122,84 v124,82
+12V
  Top 0.25: IC1.3 11.25,26 12.25,25 28,25 28.5,24.5 | 24.19,49.38 IC3.4 | 27.31,71.94 27.75,72 | 23.93,69.44 C9.1 23.75,69.62 R19.2 | 27.5,79.56 27.75,79.25 | 24.5,71.75 IC7.8 | 32.92,22 F1.2 | 36.15,21.92 D1.K
  Top 1: 27.75,49.5 27.75,29.25 C1.+ 28.5,24.5 31,22 32.92,22 | C5.1 24.19,49.38 | IC3.4 27.75,49.5 | 27.75,49.5 27.75,72 27.75,79.25 27.75,87.25 26,89 26,97.5 24.75,98.75 IC5.4 C7.1 | C9.1 24,71.75 24.5,71.75 | IC7.8 27.31,71.94 | F1.2 36.15,21.92
-5V  (via drill 0.6)  (1 unrouted)
  Top 0.25: IC2.3 18.75,34.88 C4.2 | v26,34.75 18.88,34.75 C4.2 | C4.2 18.62,31.62 v18.75,31.5 | R26.1 43,103.25 43,103.5 35.5,111 14.75,111 v7.25,103.5 | v9,33.5 6,33.5 1.25,38.25 1.25,82 7,87.75 7,99.5 5.75,100.75 5.29,100.75 J9.3 | J11.3 105.96,100.79 110.25,96.5 110.25,81.25 109.25,80.25 R58.1 109.25,73 110.5,71.75 115.75,71.75 v120,76 | R60.1 128.5,64.25 124.25,68.5 124.25,75.5 v124.75,76
  Bottom 0.25: v26,34.75 27,33.75 38.5,33.75 44.5,39.75 44.5,43.75 45.25,44.5 R9.1 | v18.75,31.5 14.5,31.5 12.5,33.5 v9,33.5 | v7.25,103.5 7.25,102.25 5.75,100.75 5.29,100.75 J9.3 | v120,76 v124.75,76
-12V  (via drill 0.6)
  Top 0.25: IC2.2 v25.5,29 | 31.81,49.38 IC3.11 | 35.39,79.56 C10.2 35.41,79.56 | 29.56,79.56 29.25,79.5 | 29.69,71.94 29.25,71.75 | 39.85,21.92 D2.A
  Top 1: IC3.11 29.25,49.5 | 29.25,49.5 29.25,34.5 C2.- 35.25,27.5 39.75,23 D2.A | C6.2 31.81,49.38 | 29.25,49.5 29.25,71.75 29.25,79.5 29.25,88 27.5,89.75 27.5,97.5 28.75,98.75 IC5.11 C8.2 | 29.56,79.56 IC7.4 35.41,79.56 | IC7.1 29.69,71.94 | F2.1 39.85,21.92
  Bottom 0.25: C2.- 33,30.75 27.25,30.75 v25.5,29
C1  (via drill 0.6)
  Top 0.25: 9.75,54.69 IC4.1 | 9.75,54.61 IC4.1 | R15.1 25.38,39.88 26.25,40.75 26.25,43.75 25.5,44.5 24.27,44.5 IC3.6 22.58,44.42 22,45 20.38,45 C11.1 19.62,45.12 v17,47.75 | R13.1 9.69,54.75 IC4.1
  Bottom 0.25: v17,47.75 14.75,47.75 9.75,52.75 9.75,54.61 IC4.1
C2  (via drill 0.6)
  Top 0.25: C12.1 9.5,64.74 | 9.5,64.74 9.92,64.74 Q1.1 | IC4.8 9.79,64.45 9.5,64.74 | IC3.2 20.92,54.58 v17.25,58.25
  Bottom 0.25: v17.25,58.25 12,58.25 9.75,60.5 9.75,62.23 IC4.8
CV  (via drill 0.6)
  Top 0.25: R10.2 7.25,50.82 7.25,51 3.5,47.25 3.5,44 4,43.5 8.75,43.5 12.5,40 R11.1 16.5,39.75 17.25,39 17.25,37.25 18,36.5 24.5,36.5 v26,38
  Bottom 0.25: v26,38 27.93,38 IC3.8
EMIT
  Top 0.25: R14.2 14.87,47.12 IC4.3 IC4.6
  Bottom 0.25: J8.5 9.75,78.67 9.75,78.5 11.5,76.75 11.5,72.75 14.87,69.38 IC4.6
EXPO
  Top 0.25: D3.A 15.22,38 11.25,38 9.75,39.5 R11.2 6.75,42.75 3.75,42.75 2.75,43.75 2.75,49 6.25,52.5 11.25,52.5 12.25,53.5 12.25,54.57 IC4.2 12.33,55.92 11.5,56.75 4,56.75 2.75,58 2.75,80.25 3.75,81.25 4.55,81.25 J8.10
GND  (via drill 0.6, 3.2, 7)  (2 unrouted)
  Top 0.25: C3.2 C4.1 | IC1.2 12.25,29 13.25,30 13.25,34.88 C3.2 | D2.K D1.A | C5.2 v20.25,53 | C6.1 34.38,47.62 33.75,47 31.85,47 IC3.10 | R12.2 4,38.25 5.5,36.75 12.25,36.75 13,36 13,35.12 C3.2 | C9.2 25.62,67.62 v25.75,67.5 | R22.1 36.12,63.88 v34.5,65.5
  other vias: 206.5,3 242.06,3 206.5,125.5 242.06,125.5 211.75,20 224.25,20 236.75,20 211.75,35 224.25,35 236.75,35 211.75,69 211.75,52 224.25,52 236.75,52 20,77.5 32.5,82 31,88.75 26.25,104.75 19.5,101 224.25,105.25 234.25,71.25 211.75,86 11.5,93.25 11.5,89.25 3.25,88.75 3.25,92.75
  pour Bottom (isolate 0.25): -0.75,114 49.25,114 49.25,13 -0.75,13
  pour Bottom (isolate 0.3): 99.75,114 148.75,114 149,13.5 99.75,13.5
  pour Bottom (isolate 0.5): 198.85,128.4 199.1,0.1 249,0.1 249.25,128.4
  pour Top (isolate 0.25): 0.25,113.5 48.25,113.5 48.25,14 0.25,14.25
  pour Top (isolate 0.3): 99.75,114 148.75,114 149,13.5 99.75,13.5
  pour Top: 198.75,128.5 249.5,128.5 249.5,0 198.75,0
MOD1  (via drill 0.6)
  Top 0.25: R1.1 v45.75,40 | v20.5,33.25 v25.75,33.25
  Bottom 0.25: v20.5,33.25 20.25,33.5 16,33.5 12.75,36.75 6.25,36.75 3.5,39.5 3.5,77.66 J8.9 | v45.75,40 39,33.25 38.75,33 26.25,33 26,33.25 v25.75,33.25
MOD2  (via drill 0.6)
  Top 0.25: R2.1 v45.75,36.75 | J8.4 12.46,81.29 13.5,80.25 13.5,76.25 12.75,75.5 8,75.5 v6.75,74.25
  Bottom 0.25: v6.75,74.25 6.75,74 7.25,73.5 7.25,64 4.25,61 4.25,49.5 5.75,48 11.5,48 12.75,46.75 12.75,43.75 24.5,32.25 39.12,32.25 43.62,36.75 v45.75,36.75
N$2
  Top 0.25: 17.25,50.75 17.25,54.25 17.5,54.5
N$3  (via drill 0.6)
  Top 0.25: R17.2 33.62,69.62 v34.25,70.25 34.25,73.5 33.25,74.5 32.33,74.5 IC7.2 | R18.1 C13.1 v39.5,71.75
  Bottom 0.25: v34.25,70.25 38,70.25 v39.5,71.75 | 32.33,74.5 IC7.2
N$4
  Top 0.25: 14,21.85 J1.+12V1
  Top 1: J1.+12V1 J1.+12V2 | F1.1 30.17,19.08 25.5,23.75 15.25,23.75 14,22.5 14,21.85
N$5
  Top 0.25: R12.1 5.88,41.38 7.25,40 R11.3
N$6
  Top 0.25: 34.25,102.12 R32.1 34.5,102.12 34.5,101.75 32.75,100 28.5,100 27.75,100.75 27.75,105.5 26.88,106.37 IC5.1 23,106.43 23,108.25 22.38,108.88 R31.2 19.12,109
N$8
  Top 0.25: R16.1 14.5,41.25 17,41.25 18.75,39.5 18.75,38.27 D3.K
N$9
  Top 0.25: R27.2 R28.2 R29.1 17.38,96.62 17.75,97 20,97 20.75,96.25 20.75,94.25 21.25,93.75 22.86,93.75 IC5.6
N$10
  Top 0.25: R20.1 9.92,71.88 Q1.3
N$11
  Top 0.25: R31.1 19.25,105.75 20,105 20,103.62 R30.2 19.88,103.38 22,101.25 22.9,101.25 IC5.3
N$16
  Top 0.25: R5.1 40.25,57 41.25,56 41.34,56 J15.3
N$17
  Top 0.25: R33.1 36.12,104.25 | 36.12,104.25 R32.2 | IC5.13 32.08,103.83 32.5,104.25 36.12,104.25
N$19
  Top 0.25: IC3.9 33.83,44.42 35,43.25 | 35,43.25 R6.2 36.5,43.38 36.5,45.5 37.75,46.75 37.75,51 36.38,52.38 R4.2 R5.2 36.38,58.38 36.75,58.75 37.75,58.75 38.12,59.12 R3.1 | R1.2 R2.2 | 42.25,36.62 R2.2 | 35,43.25 35.12,43.12 R8.2 R7.2 35.12,35.38 35.25,35.25 38,35.25 39.5,36.75 R2.2
  Bottom 0.25: IC3.9 30.08,44.42 26.25,48.25 19.82,48.25 R10.1
N$30  (via drill 0.6)
  Top 0.25: IC5.9 31.92,93.67 | 31.92,93.67 33.5,95.25 R24.2 34.5,95.12 34.5,94 34.75,93.75 R25.1 37.62,92.62 v37.75,92.5 | 31.92,93.67 31.92,93.58 | v37.75,88.5 36.38,88.5 R23.2
  Bottom 0.25: v37.75,92.5 v37.75,88.5
N$33
  Top 0.25: R24.1 37.5,95.25 42.75,100.5 R26.2
N$41
  Top 1: J1.-12V1 J1.-12V2 24.08,17.67 26.25,15.75 39.92,15.75 F2.2
N$54
  Top 0.25: R16.2 7.75,46.5 8.75,47.5 11.25,47.5 13.5,45.25 14.62,45.25 R14.1 16.75,43.38 C11.2 20.25,42.5 20.87,41.88 IC3.7
OFFSET  (via drill 0.6)
  Top 0.25: v15,70.75 15,68.75 22.25,61.5 24.25,61.5 v24.75,61 | 42.75,45.5 R9.2 | v45.25,59.75 45,59.5 45,48.5 42.75,46.25 R9.2 | R8.1 37.5,40 R9.2
  Bottom 0.25: v45.25,59.75 43.5,61.5 32.25,61.5 31.75,61 v24.75,61 | J8.3 12.25,78.71 12.25,73 14.5,70.75 v15,70.75
PW  (via drill 0.6)
  Top 0.25: R29.2 19.12,94.38 22,91.5 22.57,91.5 IC5.7 23,91.07 23,86.5 19.5,83 v15.25,83 | 18.12,102.88 R30.1 18.12,105.38 v18,105.5 | J8.7 7.13,78.88 8.5,80.25 v8.5,83
  Bottom 0.25: v18,105.5 18,92.5 19.25,91.25 22.82,91.25 IC5.7 | v8.5,83 v15.25,83
RAW  (via drill 0.6)
  Top 0.25: IC3.1 21.13,57.12 19.5,58.75 19.5,63.25 14.5,68.25 11.01,68.25 Q1.2 6.44,68.31 5.18,69.57 C12.2 5.18,76.43 6,77.25 10.25,77.25 11,78 11,83.05 13.69,85.75 15,85.75 16.5,85.75 v17.75,85.75 | v31.75,59.75 31.75,67.88 R17.1 | R23.1 34.38,87.75 | 34.38,87.75 34.38,87.38 | v34.5,86 34.5,87.62 34.38,87.75
  Bottom 0.25: IC3.1 24.25,57.18 24.25,58.25 26.25,60.25 31.25,60.25 v31.75,59.75 | v17.75,85.75 34.25,85.75 v34.5,86
RESET
  Top 0.25: R22.2 R21.1 40.25,67.25 40.75,67.75 40.75,72.5 39.75,73.5 38.25,73.5 37.88,73.88 C14.2 37.75,75.38 37.75,76.5 37.23,77.02 IC7.3
V/OCT  (via drill 0.6)
  Top 0.25: IC3.14 IC3.13 | IC3.14 31.31,57.06 33.81,57.06 34.75,58 34.75,60 35.25,60.5 R3.2 | v26.25,62.25 22.5,62.25 16.25,68.5 16.25,71 15.25,72 v15,72 | v30.75,62.25 30.75,58.18 IC3.14
  Bottom 0.25: v26.25,62.25 v30.75,62.25 | J8.1 14.75,78.5 13,76.75 13,73.25 14.25,72 v15,72

### Text on the board
bPlace: Ground me pls. | HACKSAW | HACKSAW | 0.1 | main | 0.1 | interface | CENTRE | SAW | EXP | SYN | SQR | MOD2 | MOD1 | PW | EMI | OFS | OCT | COARSE / RANGE | LO/HI | HI | OFFSET | SCALE | peaks repeat / modulated frequency / more cv | CHECK YOUR POLARITY
bNames: Niklas Andersson / CC BY-NC-SA 4.0 / DEC, 2015 | Niklas Andersson / CC BY-NC-SA 4.0 / DEC, 2015 | Niklas Andersson / CC BY-NC-SA 4.0 / Nov, 2015